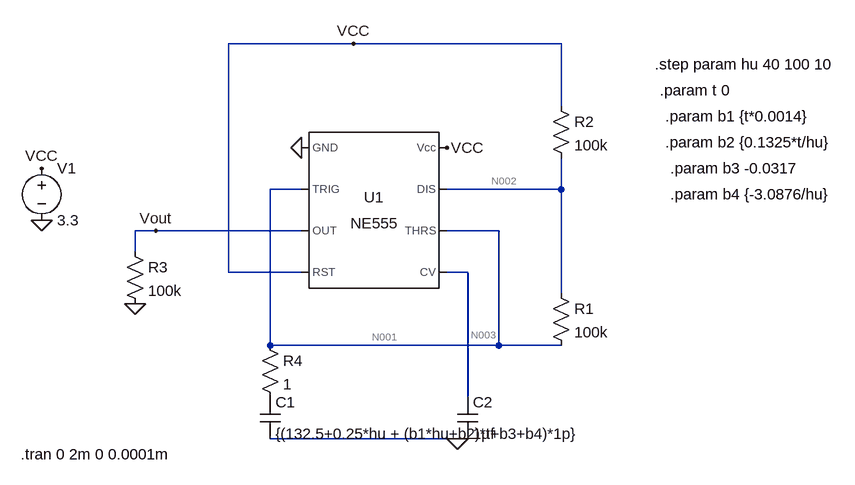
[diagram p0: schematic Draft1.asc]
Draft1.asc, the LTspice schematic file:
Version 4
SHEET 1 904 680
WIRE 112 -272 -80 -272
WIRE 432 -272 112 -272
WIRE 432 -176 432 -272
WIRE 32 -48 -16 -48
WIRE 432 -48 432 -96
WIRE 432 -48 256 -48
WIRE -192 16 -224 16
WIRE 32 16 -192 16
WIRE 336 16 256 16
WIRE -224 48 -224 16
WIRE -80 80 -80 -272
WIRE 32 80 -80 80
WIRE 288 80 256 80
WIRE 432 112 432 -48
WIRE -16 192 -16 -48
WIRE 336 192 336 16
WIRE 336 192 -16 192
WIRE 432 192 336 192
WIRE 288 272 288 80
WIRE 272 336 -16 336
WIRE 288 336 272 336
FLAG -368 0 0
FLAG -368 -80 VCC
FLAG 256 -112 VCC
FLAG 32 -112 0
FLAG 112 -272 VCC
FLAG -224 128 0
FLAG 272 336 0
FLAG -192 16 Vout
SYMBOL cap -32 272 R0
SYMATTR InstName C1
SYMATTR Value {(132.5+0.25*hu + (b1*hu+b2)*t+b3+b4)*1p}
SYMBOL Misc\\NE555 144 -16 R0
SYMATTR InstName U1
SYMBOL voltage -368 -96 R0
WINDOW 123 0 0 Left 0
WINDOW 39 0 0 Left 0
SYMATTR InstName V1
SYMATTR Value 3.3
SYMBOL cap 272 272 R0
SYMATTR InstName C2
SYMATTR Value 1µf
SYMBOL res 416 96 R0
SYMATTR InstName R1
SYMATTR Value 100k
SYMBOL res 416 -192 R0
SYMATTR InstName R2
SYMATTR Value 100k
SYMBOL res -240 32 R0
SYMATTR InstName R3
SYMATTR Value 100k
SYMBOL res -32 176 R0
SYMATTR InstName R4
SYMATTR Value 1
TEXT 576 -240 Left 2 !.step param hu 40 100 10
TEXT -400 360 Left 2 !.tran 0 2m 0 0.0001m
TEXT 584 -200 Left 2 !.param t 0
TEXT 592 -160 Left 2 !.param b1 {t*0.0014}
TEXT 592 -120 Left 2 !.param b2 {0.1325*t/hu}
TEXT 600 -80 Left 2 !.param b3 -0.0317
TEXT 600 -40 Left 2 !.param b4 {-3.0876/hu}

The netlist it stands for:
* Draft1.asc
C1 P001 0 {(132.5+0.25*hu + (b1*hu+b2)*t+b3+b4)*1p}
XU1 0 N001 Vout VCC N003 N001 N002 VCC NE555  ; pins GND TRIG OUT RST CV THRS DIS Vcc
V1 VCC 0 3.3
C2 N003 0 1µf
R1 N002 N001 100k
R2 VCC N002 100k
R3 Vout 0 100k
R4 N001 P001 1
.step param hu 40 100 10
.tran 0 2m 0 0.0001m
.param t 0
.param b1 {t*0.0014}
.param b2 {0.1325*t/hu}
.param b3 -0.0317
.param b4 {-3.0876/hu}
.lib NE555.sub
.backanno
.end

* Results of the author's LTspice run, read from the files saved beside the schematic
* Operating Point (first step), zero values left out:
*   hu = 40 
*   V(p001) = 3.298 V
*   V(n001) = 3.298 V
*   V(n003) = 2.2 V
*   V(vcc) = 3.3 V
*   V(n002) = 3.299 V
*   V(vout) = 3.3 V
*   I(R1) = 6.596 nA
*   I(R2) = 11 nA
*   I(R3) = 33 µA
*   I(V1) = -1.093 mA
*   Ix(u1:1) = -1.06 mA
*   Ix(u1:2) = 3.298 nA
*   Ix(u1:3) = -33 µA
*   Ix(u1:4) = 11.33 µA
*   Ix(u1:6) = 3.298 nA
*   Ix(u1:7) = 4.402 nA
*   Ix(u1:8) = 1.081 mA
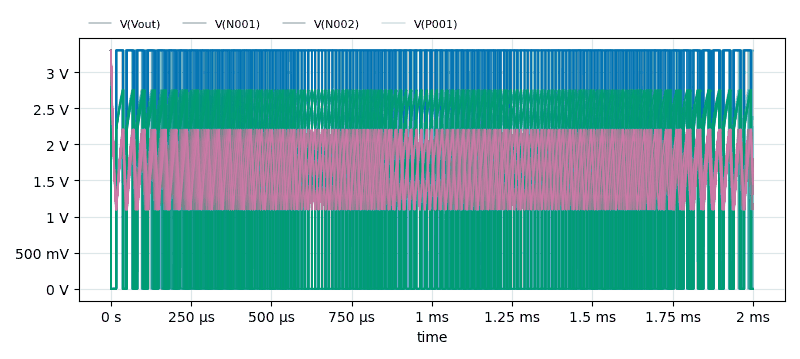
[diagram p1: Transient Analysis of Draft1.asc, plotted from the saved traces]
* Transient Analysis, 7 runs:
*   V(Vout) [hu=40]: min 19.8 µV, max 3.3 V, average 2.179 V, rms 2.681 V, last 3.3 V
*   V(Vout) [hu=50]: min 19.8 µV, max 3.3 V, average 2.176 V, rms 2.679 V, last 3.3 V
*   V(Vout) [hu=60]: min 19.8 µV, max 3.3 V, average 2.178 V, rms 2.68 V, last 19.8 µV
*   V(Vout) [hu=70]: min 19.8 µV, max 3.3 V, average 2.18 V, rms 2.681 V, last 19.8 µV
*   V(Vout) [hu=80]: min 19.8 µV, max 3.3 V, average 2.181 V, rms 2.682 V, last 19.8 µV
*   V(Vout) [hu=90]: min 19.8 µV, max 3.3 V, average 2.181 V, rms 2.682 V, last 19.8 µV
*   V(Vout) [hu=100]: min 19.8 µV, max 3.3 V, average 2.18 V, rms 2.681 V, last 19.8 µV
*   V(N001) [hu=40]: min 1.094 V, max 3.298 V, average 1.672 V, rms 1.707 V, last 1.471 V
*   V(N001) [hu=50]: min 1.094 V, max 3.298 V, average 1.673 V, rms 1.707 V, last 1.17 V
*   V(N001) [hu=60]: min 1.094 V, max 3.298 V, average 1.674 V, rms 1.708 V, last 1.31 V
*   V(N001) [hu=70]: min 1.094 V, max 3.298 V, average 1.674 V, rms 1.709 V, last 1.473 V
*   V(N001) [hu=80]: min 1.094 V, max 3.298 V, average 1.674 V, rms 1.709 V, last 1.563 V
*   V(N001) [hu=90]: min 1.094 V, max 3.298 V, average 1.675 V, rms 1.709 V, last 1.602 V
*   V(N001) [hu=100]: min 1.094 V, max 3.298 V, average 1.674 V, rms 1.709 V, last 1.449 V
*   V(N002) [hu=40]: min 263.7 µV, max 3.299 V, average 1.66 V, rms 2.043 V, last 2.385 V
*   V(N002) [hu=50]: min 263.7 µV, max 3.299 V, average 1.658 V, rms 2.042 V, last 2.235 V
*   V(N002) [hu=60]: min 263.7 µV, max 3.299 V, average 1.66 V, rms 2.043 V, last 276.6 µV
*   V(N002) [hu=70]: min 263.7 µV, max 3.299 V, average 1.661 V, rms 2.044 V, last 286.4 µV
*   V(N002) [hu=80]: min 263.7 µV, max 3.299 V, average 1.662 V, rms 2.044 V, last 291.7 µV
*   V(N002) [hu=90]: min 263.7 µV, max 3.299 V, average 1.662 V, rms 2.045 V, last 294.1 µV
*   V(N002) [hu=100]: min 263.7 µV, max 3.299 V, average 1.66 V, rms 2.044 V, last 284.9 µV
*   V(P001) [hu=40]: min 1.094 V, max 3.298 V, average 1.672 V, rms 1.707 V, last 1.471 V
*   V(P001) [hu=50]: min 1.094 V, max 3.298 V, average 1.673 V, rms 1.707 V, last 1.17 V
*   V(P001) [hu=60]: min 1.094 V, max 3.298 V, average 1.674 V, rms 1.708 V, last 1.31 V
*   V(P001) [hu=70]: min 1.094 V, max 3.298 V, average 1.674 V, rms 1.709 V, last 1.473 V
*   V(P001) [hu=80]: min 1.094 V, max 3.298 V, average 1.674 V, rms 1.709 V, last 1.563 V
*   V(P001) [hu=90]: min 1.094 V, max 3.298 V, average 1.675 V, rms 1.709 V, last 1.602 V
*   V(P001) [hu=100]: min 1.094 V, max 3.298 V, average 1.674 V, rms 1.709 V, last 1.449 V